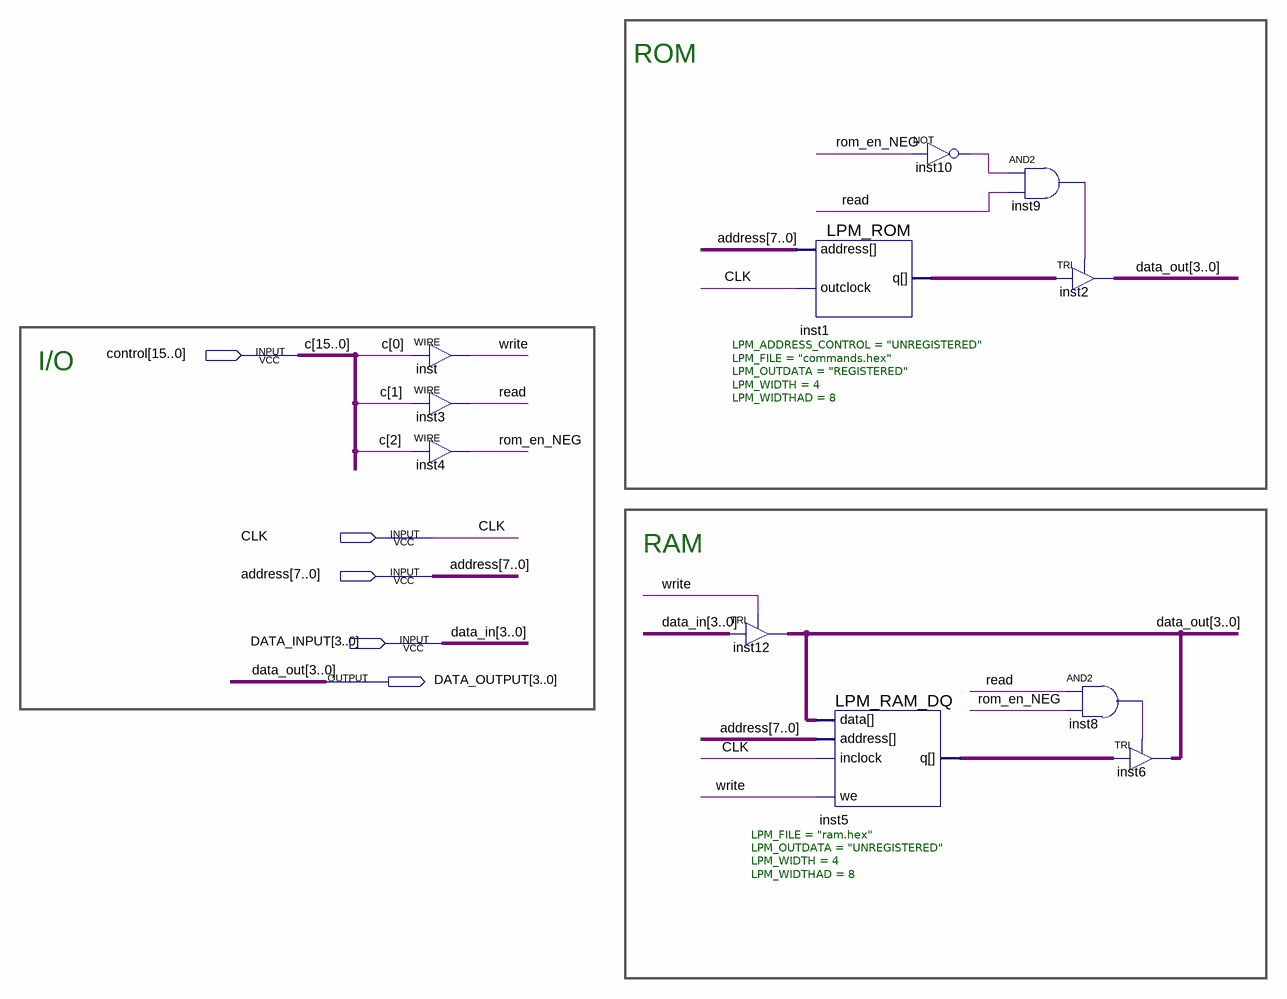
[diagram p0: schematic sheet]
// Quartus schematic _Memory_block.bdf as structural Verilog: 11 symbols, 5 pins
module _Memory_block (
  input  [15:0] control,
  input  CLK,
  input  [7:0] address,
  input  [3:0] DATA_INPUT,
  output [3:0] DATA_OUTPUT
);

  wire inst8_out, inst9_out, inst10_out, read, rom_en_NEG, write;
  wire [3:0] inst1_q, inst5_q;

  assign write = control[0];  // WIRE inst
  assign read = control[1];  // WIRE inst3
  assign rom_en_NEG = control[2];  // WIRE inst4
  TRI inst12[3:0] (.IN(DATA_INPUT), .OE(write), .OUT(DATA_OUTPUT));
  LPM_ROM #(.LPM_ADDRESS_CONTROL("UNREGISTERED"), .LPM_FILE("commands.hex"), .LPM_OUTDATA("REGISTERED"), .LPM_WIDTH(4), .LPM_WIDTHAD(8)) inst1 (
    .address(address), .outclock(CLK), .q(inst1_q));
  LPM_RAM_DQ #(.LPM_FILE("ram.hex"), .LPM_OUTDATA("UNREGISTERED"), .LPM_WIDTH(4), .LPM_WIDTHAD(8)) inst5 (
    .address(address), .data(DATA_OUTPUT), .inclock(CLK), .we(write), .q(inst5_q));
  not inst10 (inst10_out, rom_en_NEG);
  and inst9 (inst9_out, inst10_out, read);
  TRI inst2[3:0] (.IN(inst1_q), .OE(inst9_out), .OUT(DATA_OUTPUT));
  and inst8 (inst8_out, read, rom_en_NEG);
  TRI inst6[3:0] (.IN(inst5_q), .OE(inst8_out), .OUT(DATA_OUTPUT));

  // Other names for the same wires on the sheet: c[15:0] = control; data_in[3:0] = DATA_INPUT;
  //   data_out[3:0] = DATA_OUTPUT

  // Notes on the sheet:
  //   ROM
  //   I/O
  //   RAM
endmodule
